# EAGLE schematic PLC-14500 (EAGLE 7.2.0)
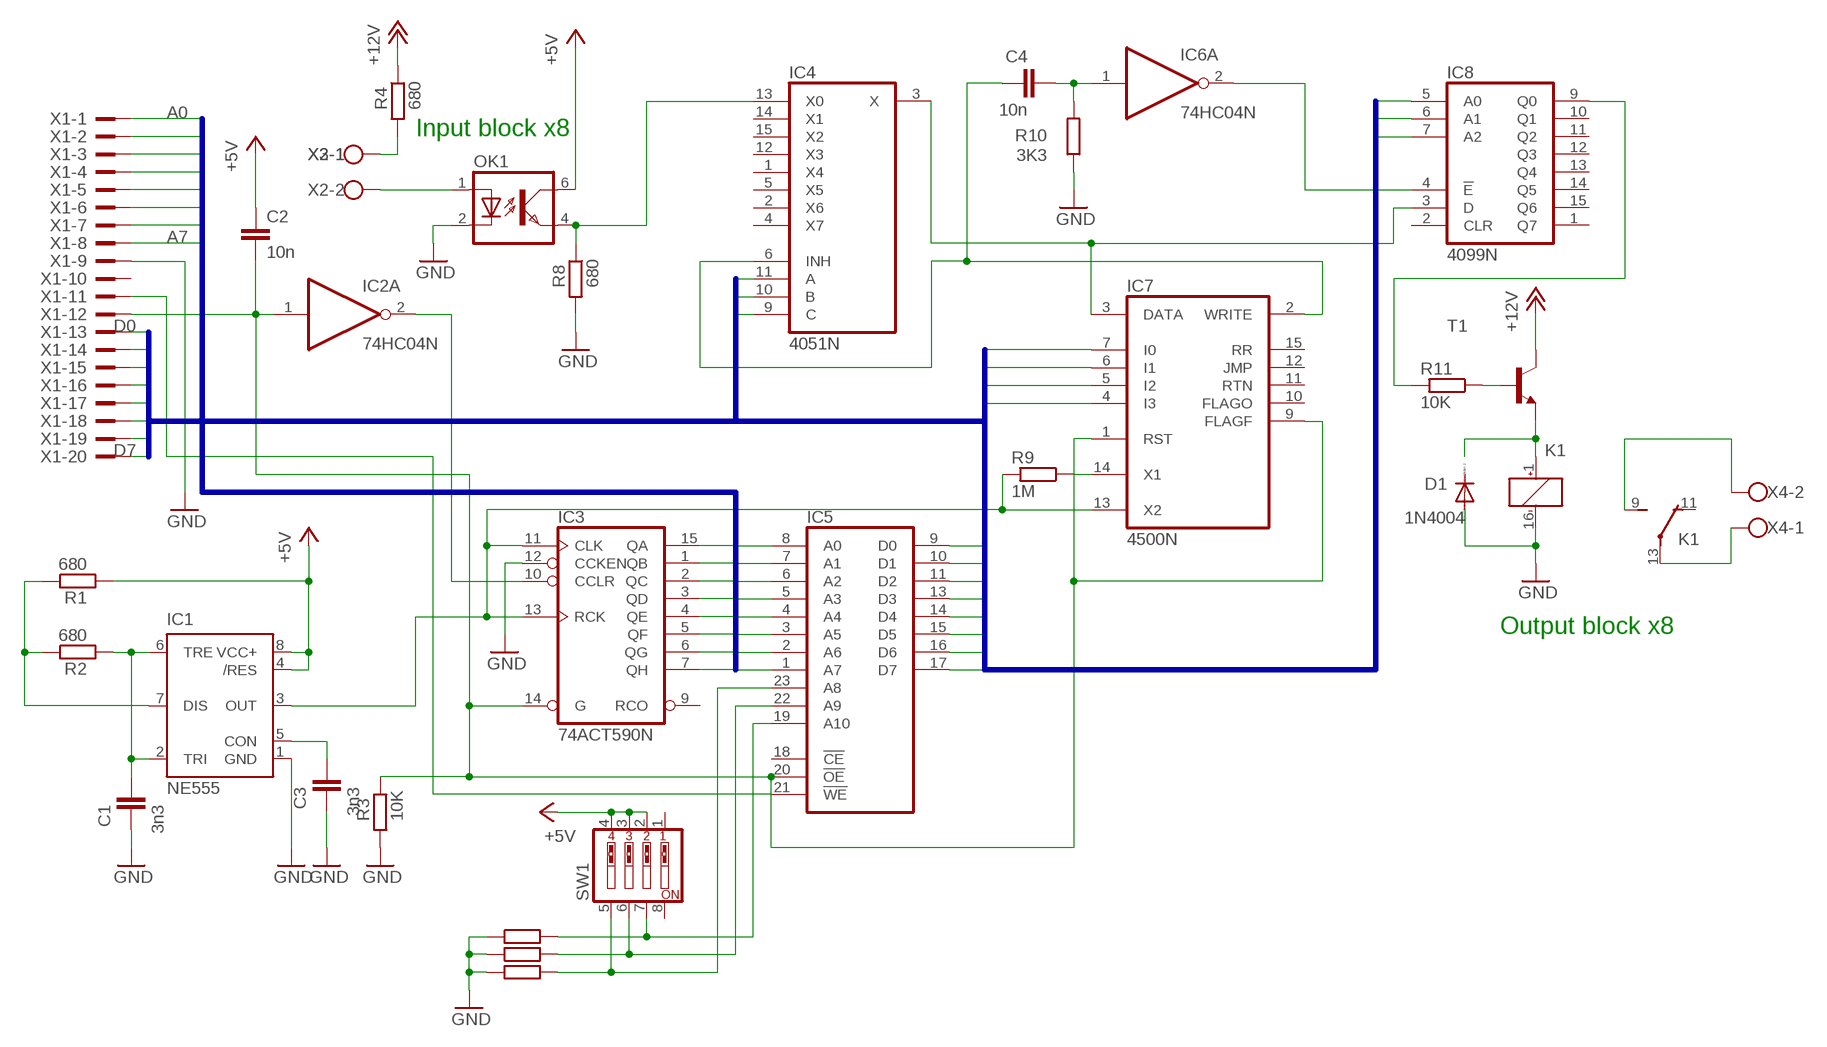
[diagram p0: schematic, sheet 1]

## Parts
C1  3n3  C-EU025-024X044  [C025-024X044]
C2  10n  C-EU025-024X044  [C025-024X044]
C3  3n3  C-EU025-024X044  [C025-024X044]
C4  10n  C-EU025-024X044  [C025-024X044]
D1  1N4004  [DO41-10]
IC1  NE555  [DIL-08]
IC2  74HC04N  [DIL14]
IC3  74ACT590N  [DIL16]
IC4  4051N  [DIL16]
IC5  2816  [DIL24]
IC6  74HC04N  [DIL14]
IC7  4500N  [DIL16]
IC8  4099N  [DIL16]
K1  DS2Y-S-DC12V  [DS2Y]
OK1  H11F1  [DIL05]
R1  680  R-EU_0204/7  [0204/7]
R2  680  R-EU_0204/7  [0204/7]
R3  10K  R-EU_0204/7  [0204/7]
R4  680  R-EU_0204/7  [0204/7]
R5  10K  R-EU_0204/7  [0204/7]
R6  10K  R-EU_0204/7  [0204/7]
R7  10K  R-EU_0204/7  [0204/7]
R8  680  R-EU_0204/7  [0204/7]
R9  1M  R-EU_0204/7  [0204/7]
R10  3K3  R-EU_0204/7  [0204/7]
R11  10K  R-EU_0204/7  [0204/7]
SW1  SW_DIP-4  [EDG-04]
T1  2N2222-NPN-TO92-EBC  [TO92-EBC]
X1  2520-  [PAK100/2500-20]
X2  W237-102  [W237-102]
X3  W237-102  [W237-102]
X4  W237-102  [W237-102]

## Nets
+5V: C2.2 IC1.4(/RES) IC1.8(VCC+) OK1.6(COL) R1.2 SW1.2 SW1.3 SW1.4
+12V: R4.1 T1.C
A0: IC3.15(QA) IC5.8(A0) X1.1
A1: IC3.1(QB) IC5.7(A1) X1.2
A2: IC3.2(QC) IC5.6(A2) X1.3
A3: IC3.3(QD) IC5.5(A3) X1.4
A4: IC3.4(QE) IC5.4(A4) X1.5
A5: IC3.5(QF) IC5.3(A5) X1.6
A6: IC3.6(QG) IC5.2(A6) X1.7
A7: IC3.7(QH) IC5.1(A7) X1.8
D0: IC5.9(D0) IC7.7(I0) X1.13
D1: IC5.10(D1) IC7.6(I1) X1.14
D2: IC5.11(D2) IC7.5(I2) X1.15
D3: IC5.13(D3) IC7.4(I3) X1.16
D4: IC4.11(A) IC5.14(D4) IC8.5(A0) X1.17
D5: IC4.10(B) IC5.15(D5) IC8.6(A1) X1.18
D6: IC4.9(C) IC5.16(D6) IC8.7(A2) X1.19
D7: IC5.17(D7) X1.20
GND: C1.1 C3.1 D1.A IC1.1(GND) IC3.12(CCKEN) K1.16(1:-) OK1.2(C) R3.2 R5.1 R6.1 R7.1 R8.2 R10.1 X1.9
N$1: C4.2 IC6.1(A:I) R10.2
N$2: IC6.2(A:O) IC8.4(!E)
N$3: C4.1 IC4.6(INH) IC7.2(WRITE)
N$4: IC7.14(X1) R9.1
N$5: IC1.3(OUT) IC3.11(CLK) IC3.13(RCK) IC7.13(X2) R9.2
N$6: IC4.3(X) IC7.3(DATA) IC8.3(D)
N$7: C2.1 IC2.1(A:I) IC3.14(G) IC5.20(!OE) IC7.1(RST) IC7.9(FLAGF) R3.1 X1.12
N$8: OK1.1(A) X2.2
N$9: R4.2 X2.1 X3.1
N$10: IC4.13(X0) OK1.4(EMIT) R8.1
N$11: IC2.2(A:O) IC3.10(CCLR)
N$12: IC5.21(!WE) X1.11
N$13: C3.2 IC1.5(CON)
N$14: C1.2 IC1.2(TRI) IC1.6(TRE) R2.2
N$16: IC1.7(DIS) R1.1 R2.1
N$17: K1.13(3:P) X4.1
N$18: K1.1(1:+) T1.E
N$19: K1.9(3:S) X4.2
N$20: R11.1 T1.B
N$21: IC8.9(Q0) R11.2
N$22: IC5.22(A9) R6.2 SW1.6
N$23: IC5.23(A8) R7.2 SW1.5
N$24: IC5.19(A10) R5.2 SW1.7
Unconnected: D1.C IC2.3(B:I) IC2.4(B:O) IC2.5(C:I) IC2.6(C:O) IC2.8(D:O) IC2.9(D:I) IC2.10(E:O) IC2.11(E:I) IC2.12(F:O) IC2.13(F:I) IC3.9(RCO) IC4.1(X4) IC4.2(X6) IC4.4(X7) IC4.5(X5) IC4.12(X3) IC4.14(X1) IC4.15(X2) IC5.18(!CE) IC6.3(B:I) IC6.4(B:O) IC6.5(C:I) IC6.6(C:O) IC6.8(D:O) IC6.9(D:I) IC6.10(E:O) IC6.11(E:I) IC6.12(F:O) IC6.13(F:I) IC7.10(FLAGO) IC7.11(RTN) IC7.12(JMP) IC7.15(RR) IC8.1(Q7) IC8.2(CLR) IC8.10(Q1) IC8.11(Q2) IC8.12(Q3) IC8.13(Q4) IC8.14(Q5) IC8.15(Q6) K1.4(2:P) K1.6(2:O) K1.8(2:S) K1.11(3:O) SW1.1 SW1.8 X1.10 X3.2

## Buses
D0,D1,D2,D3,D4,D5,D6,D7
A0,A1,A2,A3,A4,A5,A6,A7

## Notes on the sheet
- Input block x8
- Output block x8

## Power pins joined to a net without a drawn wire
GND: IC2.7(P:GND) IC3.8(GND) IC4.8(GND) IC5.12(GND) IC6.7(P:GND)
VCC: IC2.14(P:VCC) IC3.16(VCC) IC4.16(VCC) IC5.24(VCC) IC6.14(P:VCC)
VDD: IC7.16(VDD) IC8.16(VDD)
VEE: IC4.7(VEE)
VSS: IC7.8(VSS) IC8.8(VSS)

## Library data of the parts
C1-C4 = resistor:C-EU: CAPACITOR, European symbol
D1 = diode:1N4004: DIODE general purpose rectifier, 1 A
IC1 = st-microelectronics:NE555: General purpose bipolar Timer; MF: Arrow Electronics; MPN: NE555N; OC_FARNELL: 1467742; OC_NEWARK: 89K1486
IC2 IC6 = 74xx-eu:74*04: Hex INVERTER
IC3 = 74xx-eu:74*590: 8-bit binary COUNTER, output register
IC4 = 40xx:4051: 8-channel ANALOG MULTIPLEXER
IC5 = memory:2816: MEMORY
IC7 = 45xx:4500: Industrial CONTROL UNIT
IC8 = 40xx:4099: 8-Bit addressable LATCH
K1 = relay:DS2Y-S-DC*: MINIATURE RELAY NAiS Source: http://www.mew-europe.com/.. en_ds_61005_0023.pdf; MPN: DS2Y-S-DC12V; OC_FARNELL: unknown; OC_NEWARK: 13P3261
OK1 = optocoupler:H11F1: OPTO COUPLER OPTO COUPLER; OC_FARNELL: unknown; OC_NEWARK: unknown
R1-R11 = resistor:R-EU_: RESISTOR, European symbol
SW1 = special:SW_DIP-4: DIP SWITCH
T1 = transistor-neu-to92:*-NPN-: NPN Transistror
X1 = con-3m:2520-: 3M (TM) Pak 100 4-Wall Header Source: 3M; OC_FARNELL: unknown; OC_NEWARK: unknown
X2-X4 = con-wago-500:W237-102: WAGO SCREW CLAMP; MPN: 237-102; OC_FARNELL: unknown; OC_NEWARK: 70K9898